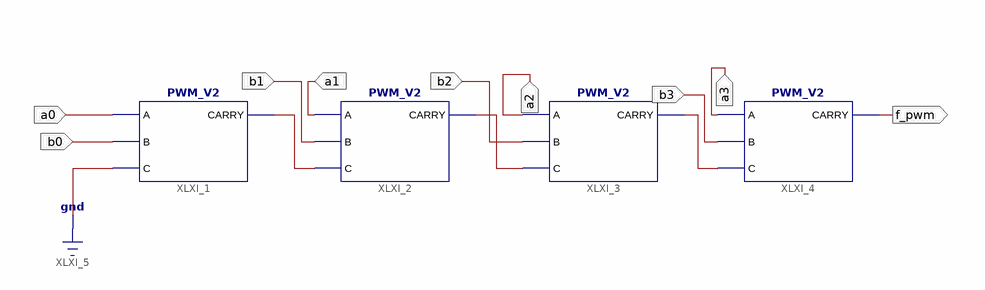
[diagram p0: schematic sheet 1]
// Xilinx ISE schematic Comparator.sch (spartan3e) as structural Verilog: 4 symbols, 9 ports
module Comparator (
  input  a0,
  input  b0,
  input  a1,
  input  b1,
  input  a2,
  input  b2,
  input  a3,
  input  b3,
  output f_pwm
);

  wire XLXN_1, XLXN_2, XLXN_3;

  PWM_V2 XLXI_1 (.A(a0), .B(b0), .C(1'b0), .CARRY(XLXN_1));
  PWM_V2 XLXI_2 (.A(a1), .B(b1), .C(XLXN_1), .CARRY(XLXN_2));
  PWM_V2 XLXI_3 (.A(a2), .B(b2), .C(XLXN_2), .CARRY(XLXN_3));
  PWM_V2 XLXI_4 (.A(a3), .B(b3), .C(XLXN_3), .CARRY(f_pwm));
endmodule
